# Altium schematic sheet Audio_Power.SchDoc
size A4; Organization: Altium Limited; Address1: L3, 12a Rodborough Rd; Address2: Frenchs Forest; Address3: NSW; Address4: Australia 2086
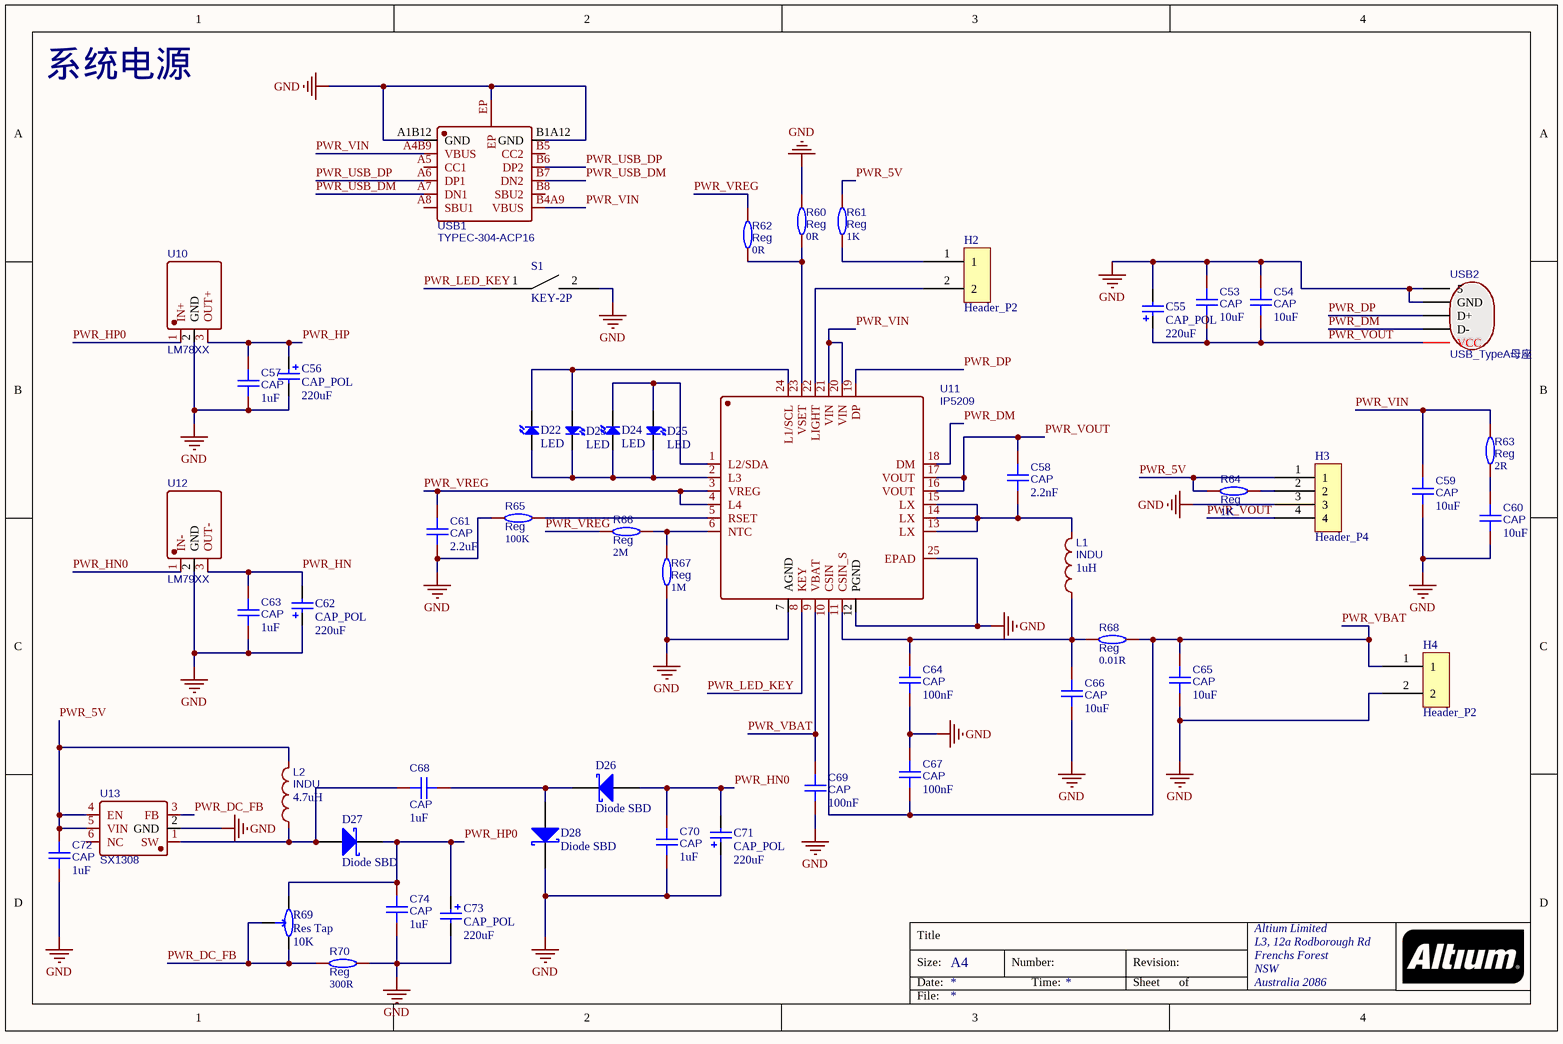
[diagram p0: Audio_Power.SchDoc]

## Parts
C53  CAP  value 10uF  [C0603]
C54  CAP  value 10uF  [C0603]
C55  CAP_POL  value 220uF  [CAP_SMD_6.3mm]
C56  CAP_POL  value 220uF  [CAP_SMD_6.3mm]
C57  CAP  value 1uF  [C0603]
C58  CAP  value 2.2nF  [C0603]
C59  CAP  value 10uF  [C0603]
C60  CAP  value 10uF  [C0603]
C61  CAP  value 2.2uF  [C0603]
C62  CAP_POL  value 220uF  [CAP_SMD_6.3mm]
C63  CAP  value 1uF  [C0603]
C64  CAP  value 100nF  [C0603]
C65  CAP  value 10uF  [C0603]
C66  CAP  value 10uF  [C0603]
C67  CAP  value 100nF  [C0603]
C68  CAP  value 1uF  [C0603]
C69  CAP  value 100nF  [C0603]
C70  CAP  value 1uF  [C0603]
C71  CAP_POL  value 220uF  [CAP_SMD_6.3mm]
C72  CAP  value 1uF  [C0603]
C73  CAP_POL  value 220uF  [CAP_SMD_6.3mm]
C74  CAP  value 1uF  [C0603]
D22  LED  [LED0603_Side]
D23  LED  [LED0603_Side]
D24  LED  [LED0603_Side]
D25  LED  [LED0603_Side]
D26  Diode SBD  [SMA_L4.3]
D27  Diode SBD  [SMA_L4.3]
D28  Diode SBD  [SMA_L4.3]
H2  Header_P2  [H_2.54_P2]
H3  Header_P4  [H_2.54_P4]
H4  Header_P2  [H_2.54_P2]
L1  INDU  value 1uH  [SMD_L7.1]
L2  INDU  value 4.7uH  [SMD_L7.1]
R60  Reg  value 0R  [R0603]
R61  Reg  value 1K  [R0603]
R62  Reg  value 0R  [R0603]
R63  Reg  value 2R  [R0603]
R64  Reg  value 1K  [R0603]
R65  Reg  value 100K  [R0603]
R66  Reg  value 2M  [R0603]
R67  Reg  value 1M  [R0603]
R68  Reg  value 0.01R  [R1206]
R69  Res Tap  value 10K  [RES_TAP_HOR]
R70  Reg  value 300R  [R0603]
S1  KEY-2P  [KEY_SOT_P2]
U10  LM78XX  [TO-220-3_2.54]
U11  IP5209  [QFN-24]
U12  LM79XX  [TO-220-3_2.54]
U13  SX1308  [SOT-23-6]
USB1  TYPEC-304-ACP16  [USB-C-SMD_TYPE-C-16P]
USB2  USB_TypeA母座  [USB_TYPEA-SMD]

## Nets
GND: C53.1 C54.1 C55.2 C56.2 C57.2 C59.2 C60.2 C61.2 C62.1 C63.2 C64.2 C65.2 C66.2 C67.1 C69.2 C70.2 C71.1 C72.2 C73.2 C74.2 D28.1(K) H3.3 H4.2 R60.2 R65.2 R67.2 R70.2 S1.2 U10.2(GND) U11.7(AGND) U11.12(PGND) U11.25(EPAD) U12.2(GND) U13.2(GND) USB1.A1B12(GND) USB1.B1A12(GND) USB1.EP USB2.4(GND) USB2.5
PWR_5V: C72.1 H3.1 L2.2 R61.2 R64.1 U13.4(EN) U13.5(VIN)
PWR_DC_FB: R69.1(A) R69.3(TAP) R70.1 U13.3(FB)
PWR_DM: U11.18(DM) USB2.2(D-)
PWR_DP: U11.19(DP) USB2.3(D+)
PWR_HN: C62.2 C63.1 U12.3(OUT-)
PWR_HN0: C70.1 C71.2 D26.2(A) U12.1(IN-)
PWR_HP: C56.1 C57.1 U10.3(OUT+)
PWR_HP0: C73.1 C74.1 D27.1(K) R69.2(B) U10.1(IN+)
PWR_LED_KEY: S1.1 U11.8(KEY)
PWR_USB_DM: USB1.A7(DN1) USB1.B7(DN2)
PWR_USB_DP: USB1.A6(DP1) USB1.B6(DP2)
PWR_VBAT: C65.1 C67.2 C69.1 H4.1 R68.2 U11.9(VBAT) U11.10(CSIN)
PWR_VIN: C59.1 R63.2 U11.20(VIN) U11.21(VIN) USB1.A4B9(VBUS) USB1.B4A9(VBUS)
PWR_VOUT: C53.2 C54.2 C55.1 C58.1 H3.4 U11.16(VOUT) U11.17(VOUT) USB2.1(VCC)
PWR_VREG: C61.1 R62.2 R66.2 U11.3(VREG) U11.4(L4)
NetC58_2: C58.2 L1.2 U11.13(LX) U11.14(LX) U11.15(LX)
NetC60_1: C60.1 R63.1
NetC64_1: C64.1 C66.1 L1.1 R68.1 U11.11(CSIN_S)
NetC68_1: C68.1 D27.2(A) L2.1 U13.1(SW)
NetC68_2: C68.2 D26.1(K) D28.2(A)
NetD22_1: D22.1(K) D23.2(A) U11.24(L1/SCL)
NetD22_2: D22.2(A) D23.1(K) D24.2(A) D25.1(K) U11.2(L3)
NetD24_1: D24.1(K) D25.2(A) U11.1(L2/SDA)
NetH2_1: H2.1 R61.1
NetH2_2: H2.2 U11.22(LIGHT)
NetH3_2: H3.2 R64.2
NetR60_1: R60.1 R62.1 U11.23(VSET)
NetR65_1: R65.1 U11.5(RSET)
NetR66_1: R66.1 R67.1 U11.6(NTC)

Not connected (* = marked no-connect by the designer): U13 6(NC); USB1 A5(CC1) A8(SBU1) B5(CC2) B8(SBU2)

## Notes on the sheet
- 系统电源
- Title
- Size:
- Date:
- A4
- Number:
- Time:
- Revision:
- Sheet
- of
- File:

## Library data of the parts
C53 C54 C57-C61 C63-C70 C72 C74 = CAP: BOM_Manufacturer: Huaxin S&T; BOM_Manufacturer Part: 0603B103K101CT; nameAlias: Capacitance; Contributor: LCSC; BOM_Supplier: LCSC; BOM_Supplier Part: C302008; spicePre: C; spiceSymbolName: 0603B103K101CT
C55 C56 C62 C71 C73 = CAP_POL: 极性电容
D22-D25 = LED0: Published: 8-Jun-2000; LatestRevisionDate: 08-Jul-2005; LatestRevisionNote: Mech Layer 1 removed.; PackageReference: LED-0; Publisher: Altium Limited; PackageDescription: LED; 2 Leads
D26-D28 = Diode SBD: Schottky Rectifier; Note: Terminal 2 is the TAB and is electrically connected to the cathode; Published: 8-Jun-2000; LatestRevisionDate: 17-Jul-2002; LatestRevisionNote: Re-released for DXP Platform.; DatasheetVersion: PD-2.057B; PackageVersion: Feb-1998; PackageReference: TO-220AC; Publisher: Altium Limited; PackageDescription: TO, Thru-Hole, Vertical, Heatsink Mounted; 3 In-Line Leads (1 Absent); Pitch 2.54 mm; ComponentLink1Description: Manufacturer Link; ComponentLink1URL: http://www.irf.com/; ComponentLink2Description: Datasheet; ComponentLink2URL: http://www.irf.com/product-info/datasheets/data/10tq.pdf
H2 H4 = Header_P2: 2Pin排针
H3 = Header_P4: 4Pin排针
L1 L2 = IND: 电感; BOM_Manufacturer: Sunltech Tech; BOM_Manufacturer Part: SLO0630H150MTT; nameAlias: Inductance; Contributor: LCSC; BOM_Supplier: LCSC; BOM_Supplier Part: C182182; BOM_JLCPCB Part Class: Extended Part; spicePre: L; spiceSymbolName: SLO0630H150MTT
R60-R68 R70 = Res: 电阻; BOM_Manufacturer: Viking Tech; BOM_Manufacturer Part: AR03BTCX1002A; nameAlias: Resistance (Ohms); Contributor: LCSC; BOM_Supplier: LCSC; BOM_Supplier Part: C465721; spicePre: R; spiceSymbolName: AR03BTCX1002A
R69 = Res Tap: 可调电阻; Sim Note: Enter the Resistance value and the set point into parameter fields.; Set Position: 0.5; Published: 24-Mar-1999; LatestRevisionDate: 17-Jul-2002; LatestRevisionNote: Re-released for DXP Platform.; PackageReference: VR3; Publisher: Altium Limited; PackageDescription: Variable Resistor, Thru-Hole; 3 Leads
S1 = KEY_2P: KEY-2Pp
U10 = LM78XX: 三端稳压(正电压); BOM_Manufacturer: HGSEMI(华冠); BOM_Manufacturer Part: LM7812T; Contributor: LCSC; BOM_Supplier: LCSC; BOM_Supplier Part: C2902509; BOM_JLCPCB Part Class: Extended Part; spicePre: U; spiceSymbolName: LM7812T
U11 = IP5209: USB充电宝; BOM_Manufacturer: INJOINIC; Contributor: LCSC; BOM_Supplier: LCSC; BOM_Supplier Part: C181695; BOM_Manufacturer Part: IP5209; BOM_JLCPCB Part Class: Extended Part; spicePre: U; spiceSymbolName: IP5209
U12 = LM79XX: 三端稳压(负电压); BOM_Manufacturer: HGSEMI(华冠); BOM_Manufacturer Part: LM7812T; Contributor: LCSC; BOM_Supplier: LCSC; BOM_Supplier Part: C2902509; BOM_JLCPCB Part Class: Extended Part; spicePre: U; spiceSymbolName: LM7812T
U13 = SX1308: 升压PWM; BOM_Manufacturer: SX; sourceId: g4Yg9rJ1j; timeStamp: 1472247539; BOM_Supplier: LCSC; BOM_Manufacturer Part: SX1308; BOM_Supplier Part: C78162; BOM_JLCPCB Part Class: Extended Part; spicePre: U; spiceSymbolName: SX1308
USB1 = USB_TYPEC_12P: 全引脚USB TYPEC母座; BOM_Manufacturer: XUNPU(讯普); Contributor: LCSC; BOM_Supplier: LCSC; BOM_Supplier Part: C2982555; BOM_Manufacturer Part: TYPEC-304-ACP16; BOM_JLCPCB Part Class: Extended Part; spicePre: U; spiceSymbolName: TYPEC-304-ACP16
USB2 = USB-TYPEA: BOM_Manufacturer: ValuePro; BOM_Manufacturer Part: YJ-USB-AF-SMT-01; BOM_Supplier: LCSC; BOM_Supplier Part: C8328; BOM_JLCPCB Part Class: Extended Part; spicePre: U; spiceSymbolName: YJ-USB-AF-SMT-01